# EAGLE schematic arduino_minimal_1stk (EAGLE 7.2.0)
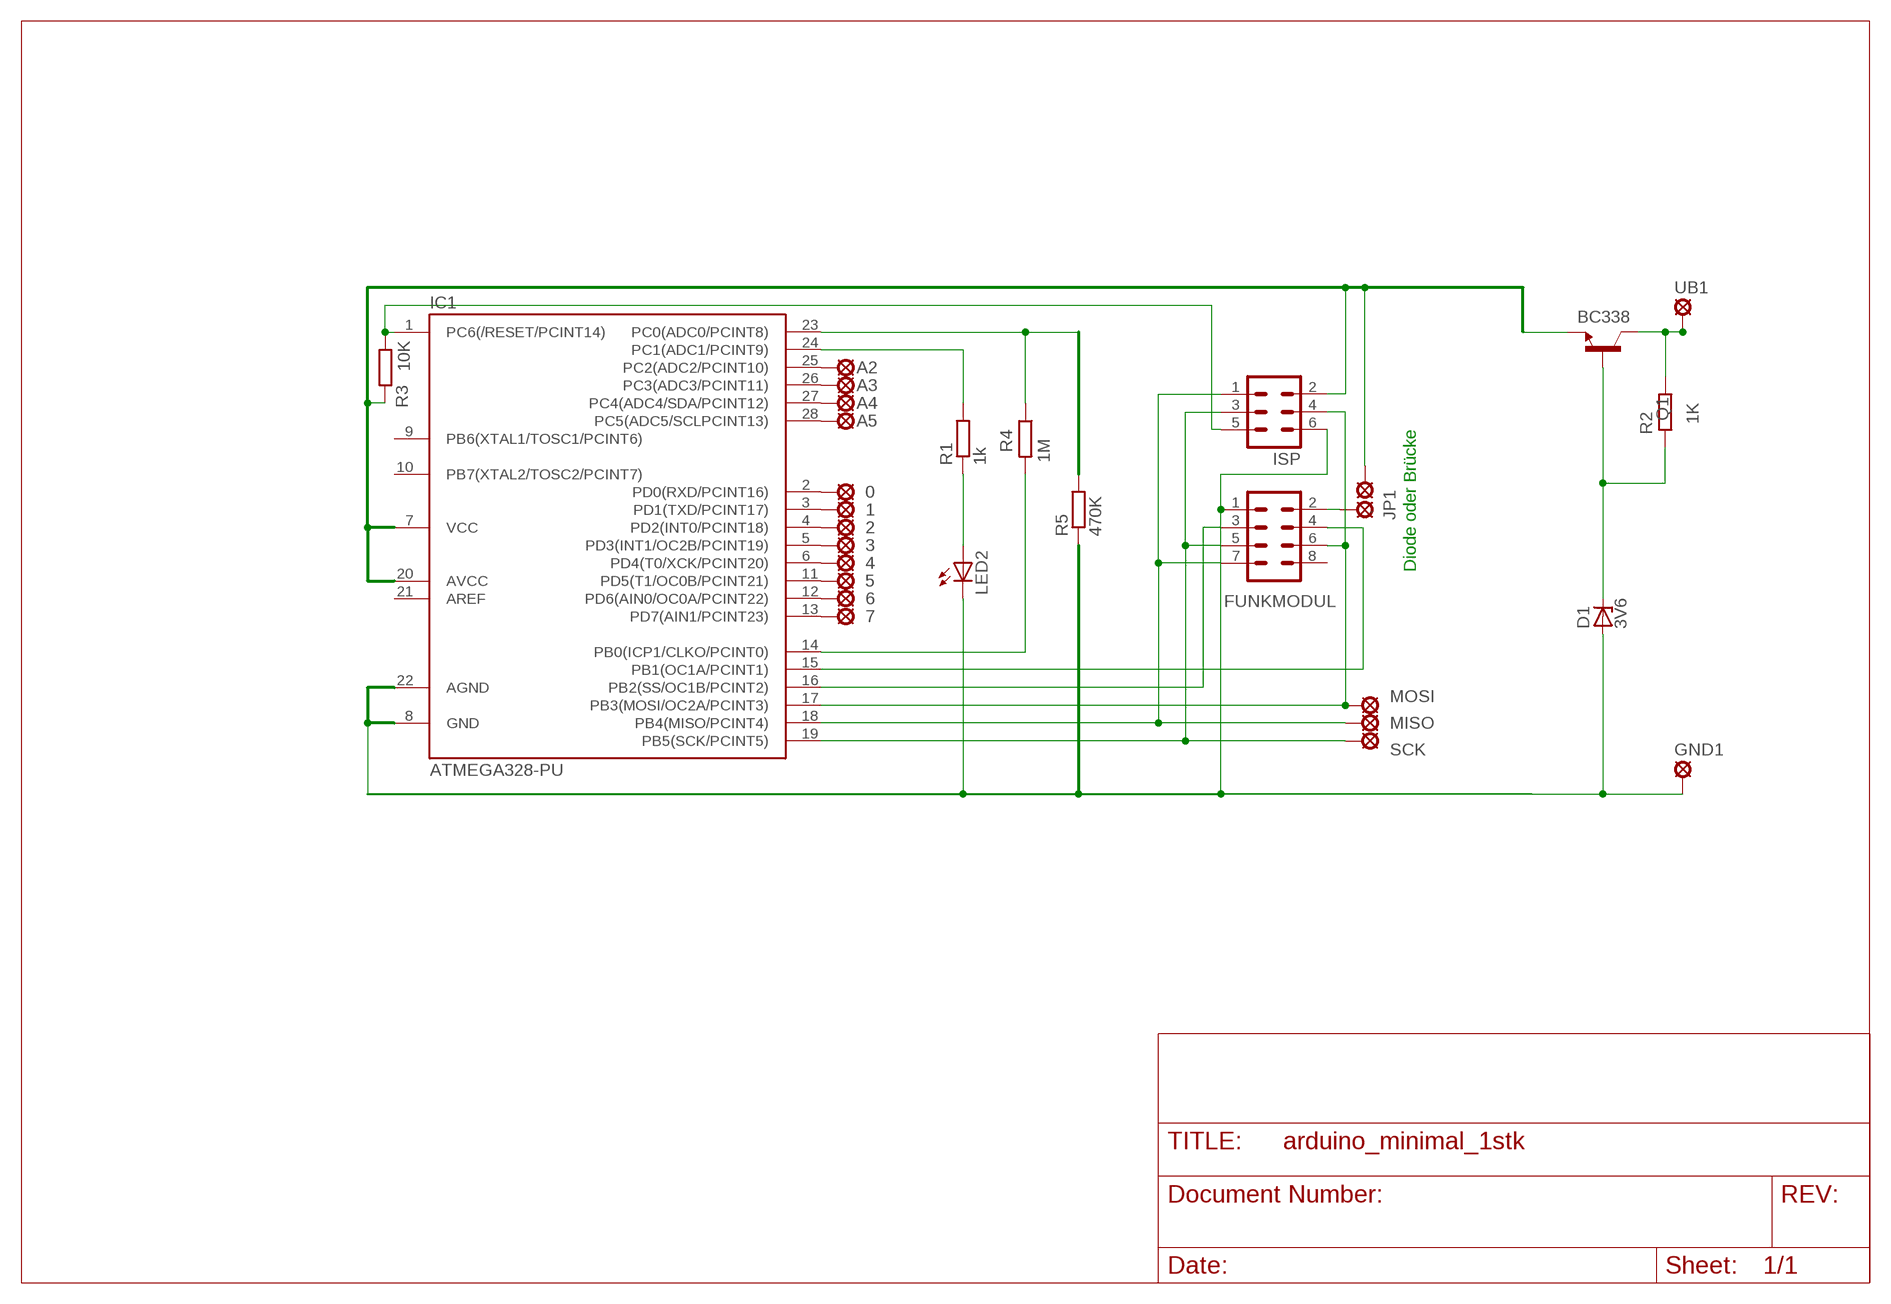
[diagram p0: schematic, sheet 1]

## Parts
0  LSP10  [LSP10]
1  LSP10  [LSP10]
2  LSP10  [LSP10]
3  LSP10  [LSP10]
4  LSP10  [LSP10]
5  LSP10  [LSP10]
6  LSP10  [LSP10]
7  LSP10  [LSP10]
.  LSP10  [LSP10]
A2  LSP10  [LSP10]
A3  LSP10  [LSP10]
A4  LSP10  [LSP10]
A5  LSP10  [LSP10]
D1  3V6  1N4728  [DO41Z10]
FUNKMODUL  MA04-2  [MA04-2]
GND1  LSP10  [LSP10]
IC1  ATMEGA328-PU  MEGA48/88/168-PU  [DIL28-3]
ISP  MA03-2  [MA03-2]
JP1  LSP10  [LSP10]
LED2  LED3MM  [LED3MM]
MISO  LSP10  [LSP10]
MOSI  LSP10  [LSP10]
Q1  BC338  [TO92-EBC]
R1  1k  R-EU_0204/7  [0204/7]
R2  1K  R-EU_0204/7  [0204/7]
R3  10K  R-EU_0204/7  [0204/7]
R4  1M  R-EU_0204/7  [0204/7]
R5  470K  R-EU_0204/7  [0204/7]
SCK  LSP10  [LSP10]
UB1  LSP10  [LSP10]

## Nets
CE1: FUNKMODUL.3 IC1.16(PB2(SS/OC1B/PCINT2))
CSN1: FUNKMODUL.4 IC1.15(PB1(OC1A/PCINT1))
GND: D1.A FUNKMODUL.1 GND1.MP IC1.8(GND) IC1.22(AGND) ISP.6 LED2.K(C) R5.1
MISO1: FUNKMODUL.7 IC1.18(PB4(MISO/PCINT4)) ISP.1 MISO.MP
MOSI1: FUNKMODUL.6 IC1.17(PB3(MOSI/OC2A/PCINT3)) ISP.4 MOSI.MP
N$2: ..MP FUNKMODUL.2
N$3: IC1.14(PB0(ICP1/CLKO/PCINT0)) R4.2
N$5: IC1.23(PC0(ADC0/PCINT8)) R4.1 R5.2
N$9: IC1.24(PC1(ADC1/PCINT9)) R1.2
N$10: LED2.A R1.1
N$33: 7.MP IC1.13(PD7(AIN1/PCINT23))
N$34: 6.MP IC1.12(PD6(AIN0/OC0A/PCINT22))
N$35: 5.MP IC1.11(PD5(T1/OC0B/PCINT21))
N$36: 4.MP IC1.6(PD4(T0/XCK/PCINT20))
N$37: 3.MP IC1.5(PD3(INT1/OC2B/PCINT19))
N$38: 2.MP IC1.4(PD2(INT0/PCINT18))
N$39: 1.MP IC1.3(PD1(TXD/PCINT17))
N$40: 0.MP IC1.2(PD0(RXD/PCINT16))
N$41: A2.MP IC1.25(PC2(ADC2/PCINT10))
N$42: A3.MP IC1.26(PC3(ADC3/PCINT11))
N$43: A4.MP IC1.27(PC4(ADC4/SDA/PCINT12))
N$44: A5.MP IC1.28(PC5(ADC5/SCLPCINT13))
N$47: Q1.C R2.1 UB1.MP
N$48: D1.C Q1.B R2.2
RES: IC1.1(PC6(/RESET/PCINT14)) ISP.5 R3.1
SCK1: FUNKMODUL.5 IC1.19(PB5(SCK/PCINT5)) ISP.3 SCK.MP
VCC: IC1.7(VCC) IC1.20(AVCC) ISP.2 JP1.MP Q1.E R3.2
Unconnected: FUNKMODUL.8 IC1.9(PB6(XTAL1/TOSC1/PCINT6)) IC1.10(PB7(XTAL2/TOSC2/PCINT7)) IC1.21(AREF)

## Notes on the sheet
- Diode oder Brücke

## Library data of the parts
0 1-7 . A2-A5 GND1 JP1 MISO MOSI SCK UB1 = solpad:LSP10: SOLDER PAD drill 1.0 mm, distributor Buerklin, 12H555
D1 = diode:1N4728: Z DIODE 3.3 V, 1W, 5 percent
FUNKMODUL = con-lstb:MA04-2: PIN HEADER; OC_FARNELL: unknown; OC_NEWARK: unknown
IC1 = avr-7:MEGA48/88/168-PU
ISP = con-lstb:MA03-2: PIN HEADER; OC_FARNELL: unknown; OC_NEWARK: unknown
LED2 = led:LED: LED OSRAM: - CHIPLED LG R971, LG N971, LY N971, LG Q971, LY Q971, LO R971, LY R971 LH N974, LH R974 LS Q976, LO Q976, LY Q976 LO Q996 - Hyper CHIPLED LW Q18S LB Q993, LB Q99A, LB R99A - SideLED LS A670, LO A670, LY A670, LG A670, LP A670 LB A673, LV A673, LT A673, LW A673 LH A674 LY A675 LS A676, LA A676, LO A676, LY A676, LW A676 LS A679, LY A679, LG A679 - Hyper Micro SIDELED® LS Y876, LA Y876, LO Y876, LY Y876 LT Y87S - SmartLED LW L88C, LW L88S LB L89C, LB L89S, LG L890 LS L89K, LO L89K, LY L89K LS L896, LA L896, LO L896, LY L896 - TOPLED LS T670, LO T670, LY T670, LG T670, LP T670 LSG T670, LSP T670, LSY T670, LOP T670, LYG T670 LG T671, LOG T671, LSG T671 LB T673, LV T673, LT T673, LW T673 LH T674 LS T676, LA T676, LO T676, LY T676, LB T676, LH T676, LSB T676, LW T676 LB T67C, LV T67C, LT T67C, LS T67K, LO T67K, LY T67K, LW E67C LS E67B, LA E67B, LO E67B, LY E67B, LB E67C, LV E67C, LT E67C LW T67C LS T679, LY T679, LG T679 LS T770, LO T770, LY T770, LG T770, LP T770 LB T773, LV T773, LT T773, LW T773 LH T774 LS E675, LA E675, LY E675, LS T675 LS T776, LA T776, LO T776, LY T776, LB T776 LHGB T686 LT T68C, LB T68C - Hyper Mini TOPLED® LB M676 - Mini TOPLED Santana® LG M470 LS M47K, LO M47K, LY M47K Source: http://www.osram.convergy.de LUXEON: - LUMILED® LXK2-PW12-R00, LXK2-PW12-S00, LXK2-PW14-U00, LXK2-PW14-V00 LXK2-PM12-R00, LXK2-PM12-S00, LXK2-PM14-U00 LXK2-PE12-Q00, LXK2-PE12-R00, LXK2-PE12-S00, LXK2-PE14-T00, LXK2-PE14-U00 LXK2-PB12-K00, LXK2-PB12-L00, LXK2-PB12-M00, LXK2-PB14-N00, LXK2-PB14-P00, LXK2-PB14-Q00 LXK2-PR12-L00, LXK2-PR12-M00, LXK2-PR14-Q00, LXK2-PR14-R00 LXK2-PD12-Q00, LXK2-PD12-R00, LXK2-PD12-S00 LXK2-PH12-R00, LXK2-PH12-S00 LXK2-PL12-P00, LXK2-PL12-Q00, LXK2-PL12-R00 Source: www.luxeon.com KINGBRIGHT: KA-3528ASYC Source: www.kingbright.com
Q1 = transistor-npn:BC338*: NPN Transistor
R1-R5 = resistor:R-EU_: RESISTOR, European symbol